# Altium project DisplayPCB.PrjPcb (part 1 of 3)
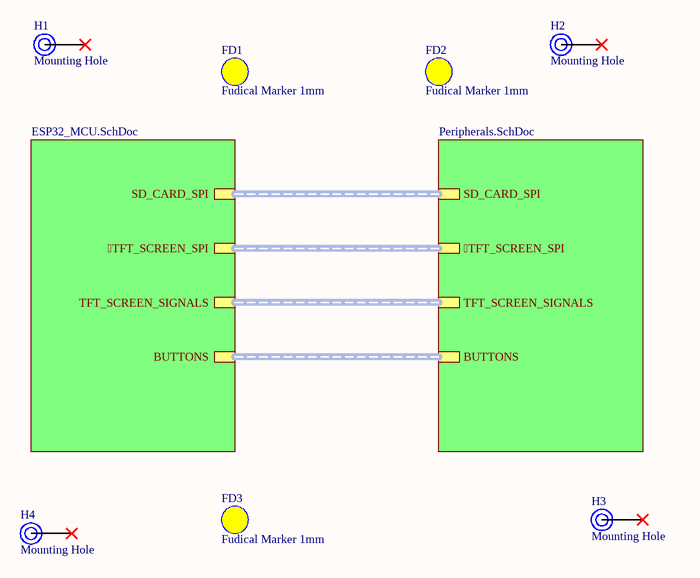
[diagram p0: DisplaySheet.SchDoc]
3 sheets, 108 parts. Net scope: hierarchical (ports join the sheet entries above them; power ports are global).
Board file: DisplayPCB.PcbDoc
Sheets:
  DisplaySheet.SchDoc
    U_ESP32_MCU = ESP32_MCU.SchDoc
    U_Peripherals = Peripherals.SchDoc

## Sheet DisplaySheet.SchDoc
size A4; SheetNumber: 1; SheetTotal: 3

### Parts
FD1  Fudical Marker 1mm  [FIDUCIAL-1MM]
FD2  Fudical Marker 1mm  [FIDUCIAL-1MM]
FD3  Fudical Marker 1mm  [FIDUCIAL-1MM]
H1  Mounting Hole  [Mounting Holes-Footprint-1]
H2  Mounting Hole  [Mounting Holes-Footprint-1]
H3  Mounting Hole  [Mounting Holes-Footprint-1]
H4  Mounting Hole  [Mounting Holes-Footprint-1]

### Sub-sheets
U_ESP32_MCU = ESP32_MCU.SchDoc: SD_CARD_SPI (harness SD_CARD_SPI), TFT_SCREEN_SPI (harness TFT_SCREEN_SPI), TFT_SCREEN_SIGNALS (harness TFT_SCREEN_SIGNALS), BUTTONS (harness BUTTONS)
U_Peripherals = Peripherals.SchDoc: SD_CARD_SPI (harness SD_CARD_SPI), TFT_SCREEN_SPI (harness TFT_SCREEN_SPI), TFT_SCREEN_SIGNALS (harness TFT_SCREEN_SIGNALS), BUTTONS (harness BUTTONS)

### Nets

Not connected (* = marked no-connect by the designer): H1 0*; H2 0*; H3 0*; H4 0*

### Buses and harness runs
harness sheet U_ESP32_MCU/TFT_SCREEN_SPI = sheet U_Peripherals/TFT_SCREEN_SPI
harness sheet U_ESP32_MCU/BUTTONS = sheet U_Peripherals/BUTTONS
harness sheet U_ESP32_MCU/SD_CARD_SPI = sheet U_Peripherals/SD_CARD_SPI
harness sheet U_ESP32_MCU/TFT_SCREEN_SIGNALS = sheet U_Peripherals/TFT_SCREEN_SIGNALS

### Library data of the parts
FD1-FD3 = FD
H1-H4 = CMP-108-0002-3: Mechanical mounting hole for vertical stack

## Sheet ESP32_MCU.SchDoc
size A2; SheetNumber: 2; SheetTotal: 3
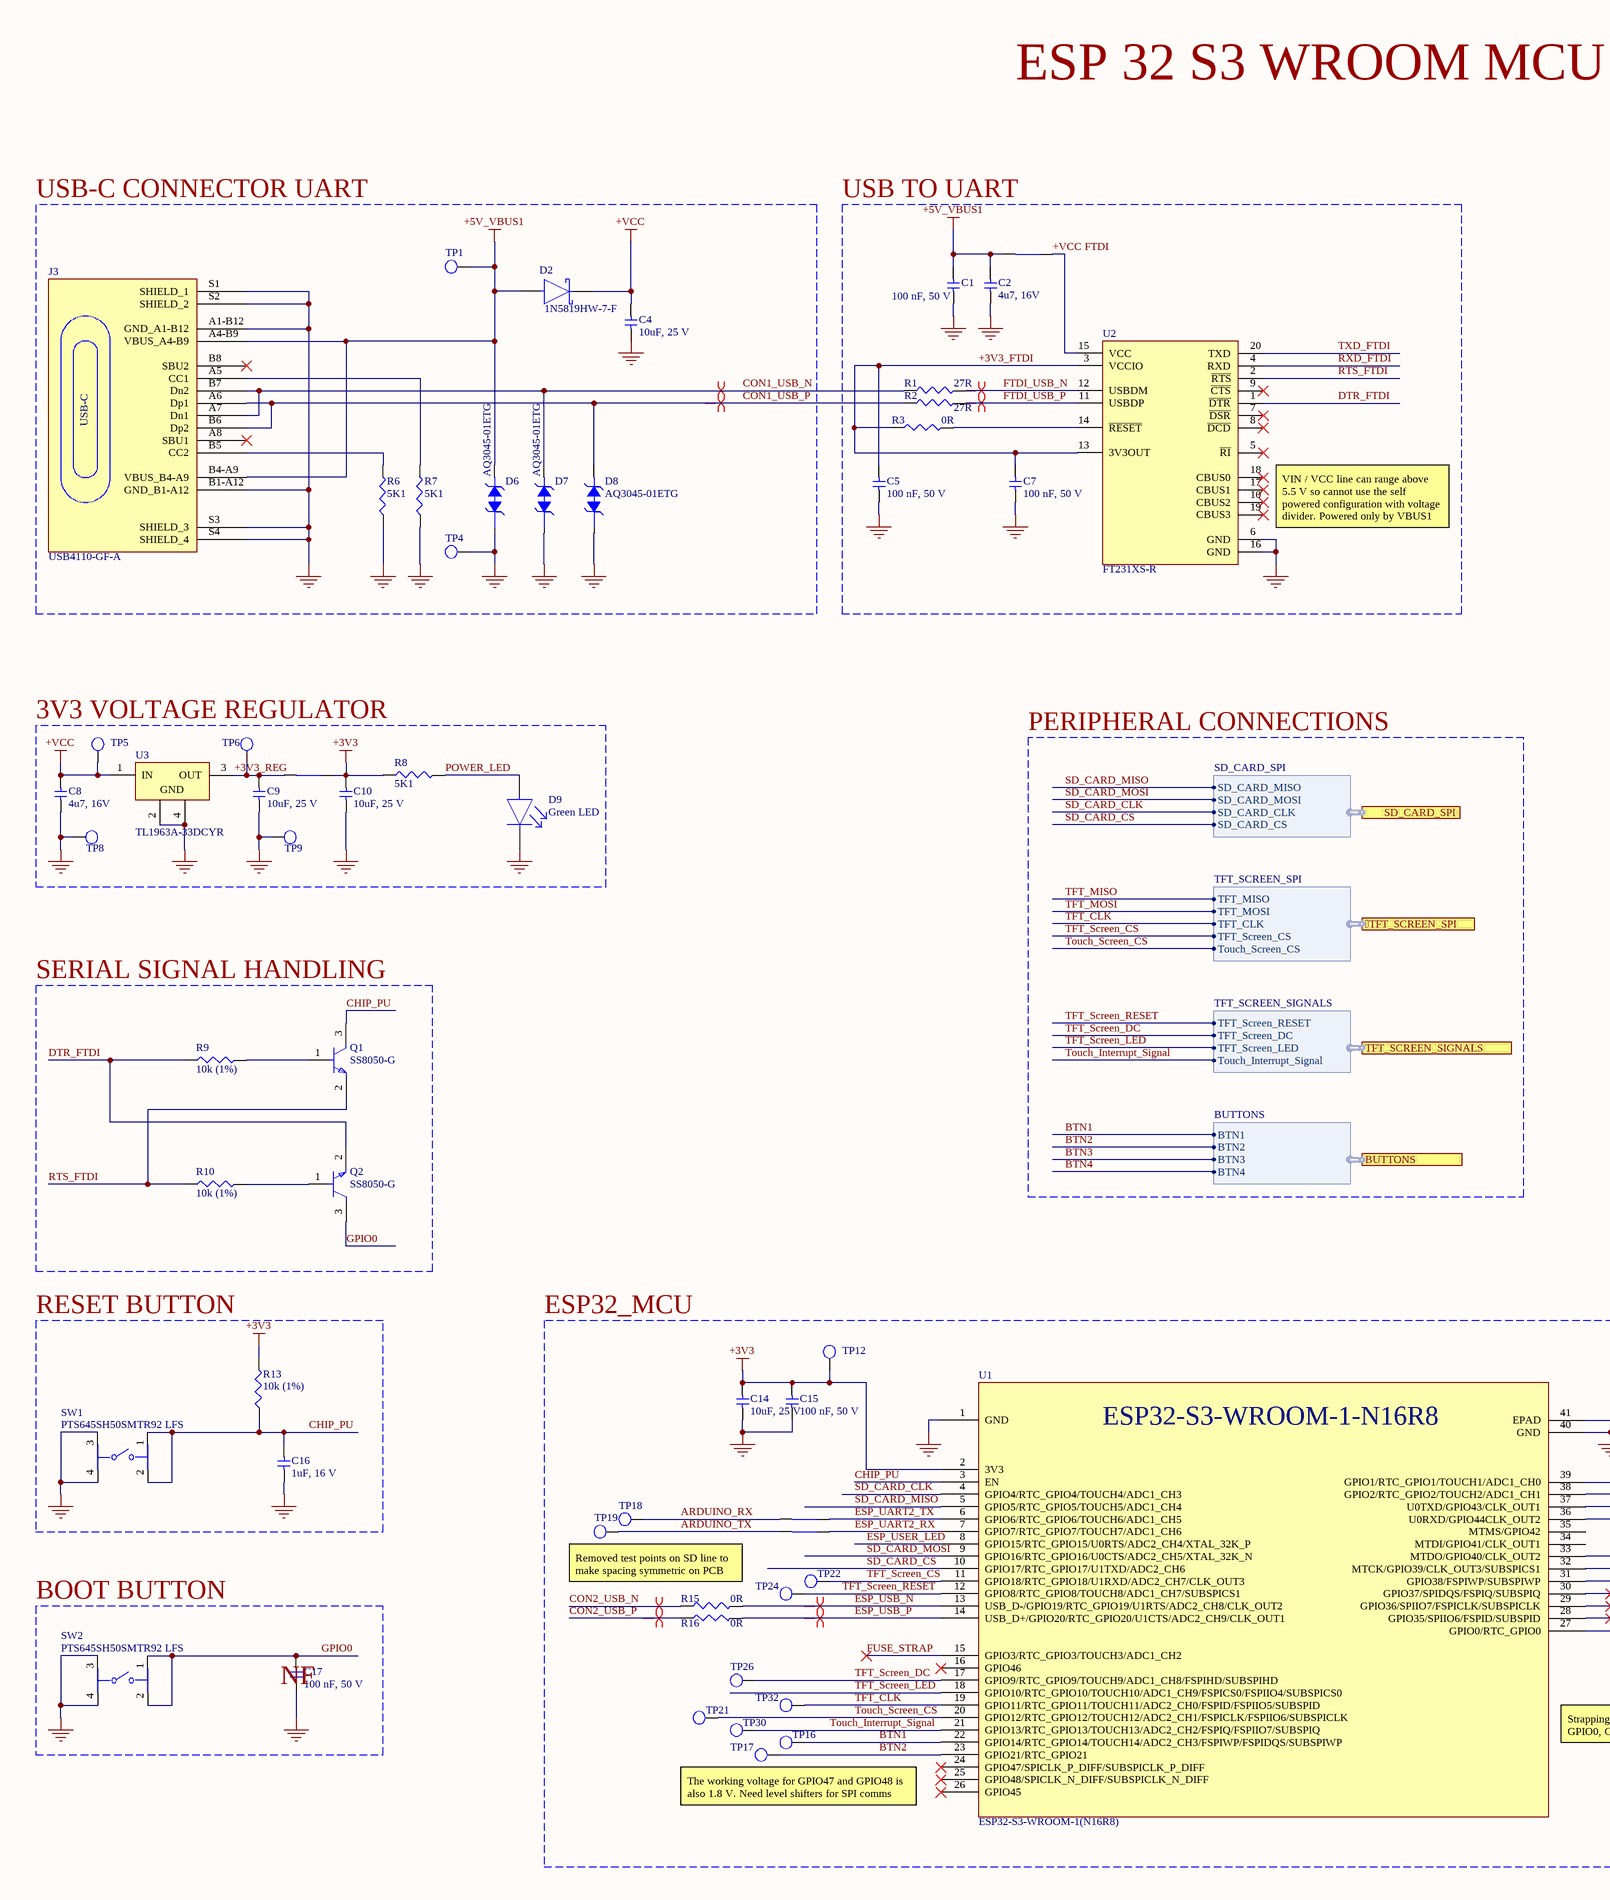
[diagram p1: ESP32_MCU.SchDoc, left]
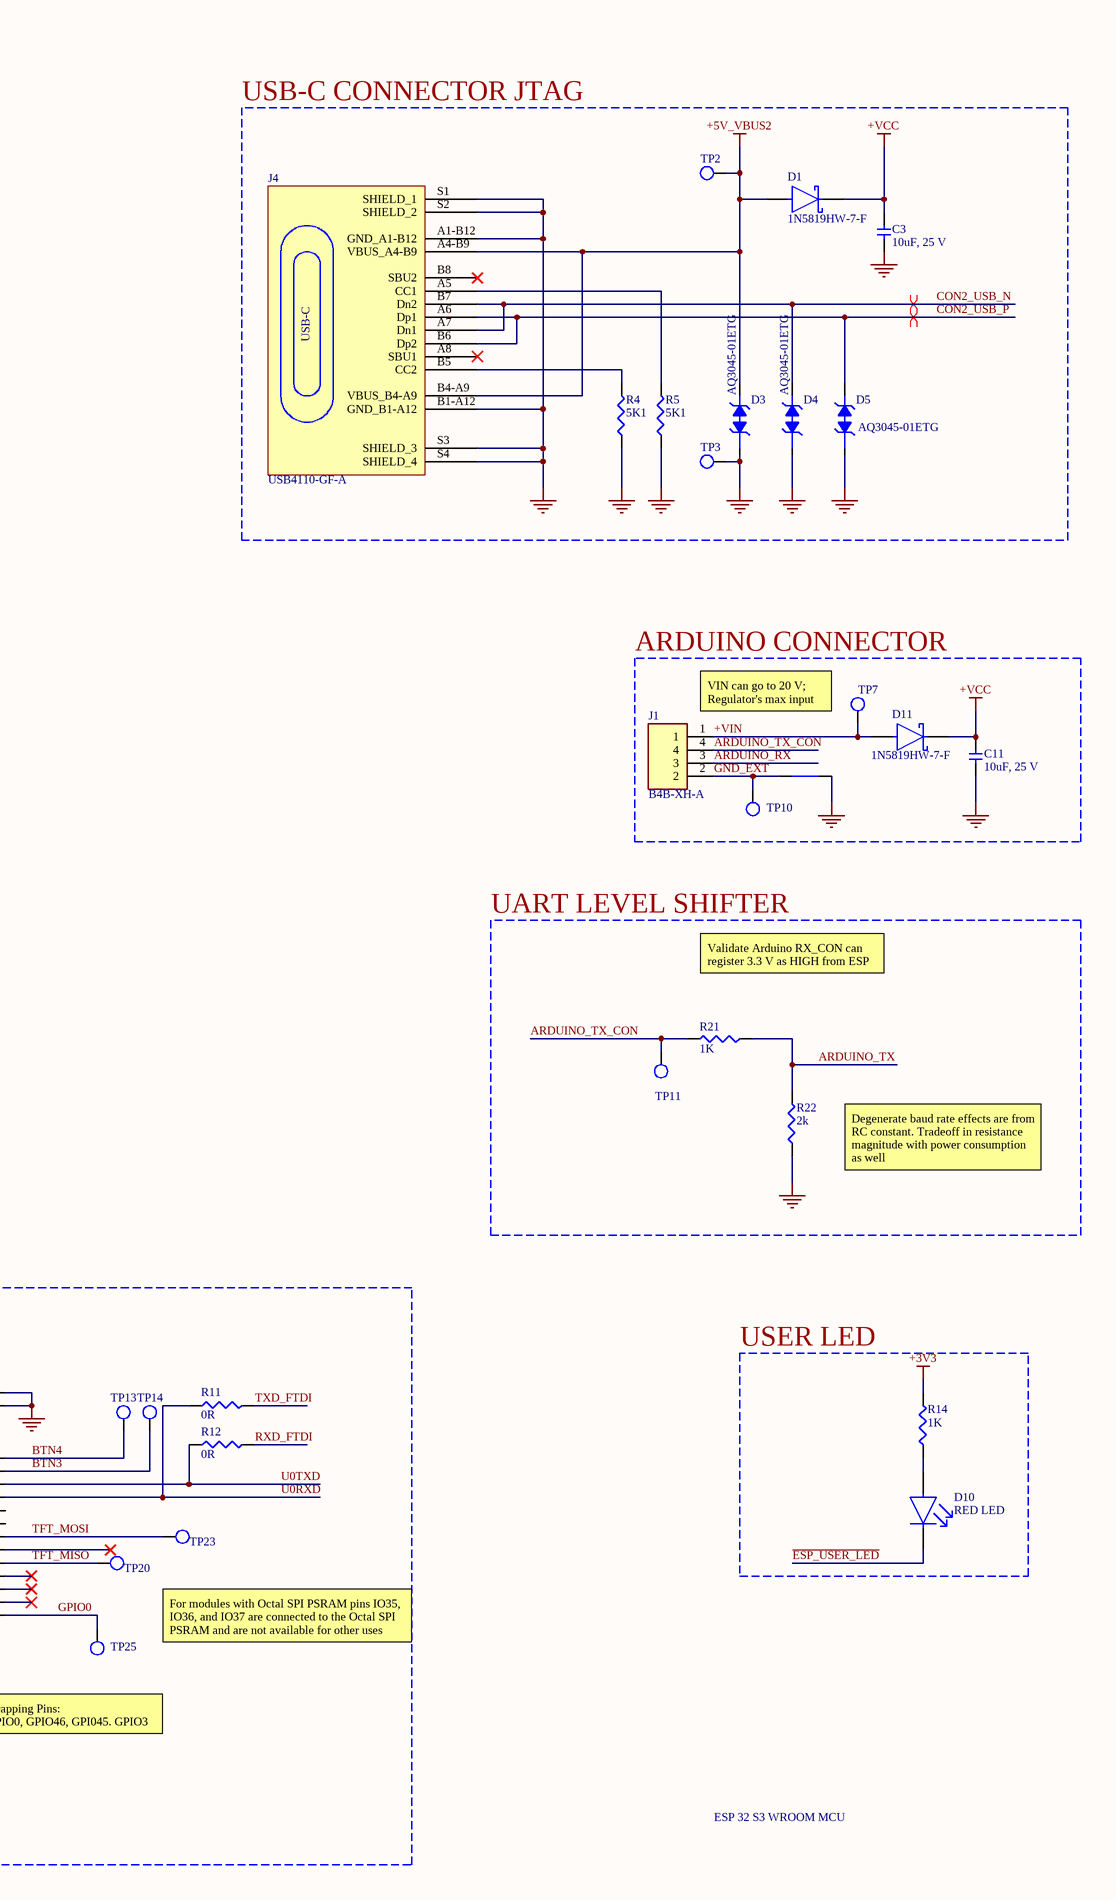
[diagram p2: ESP32_MCU.SchDoc, right]

### Parts
C1  100 nF, 50 V  [0805_CAP]
C2  4u7, 16V  [0805_CAP]
C3  10uF, 25 V  [0805_CAP]
C4  10uF, 25 V  [0805_CAP]
C5  100 nF, 50 V  [0805_CAP]
C7  100 nF, 50 V  [0805_CAP]
C8  4u7, 16V  [0805_CAP]
C9  10uF, 25 V  [0805_CAP]
C10  10uF, 25 V  [0805_CAP]
C11  10uF, 25 V  [0805_CAP]
C14  10uF, 25 V  [0805_CAP]
C15  100 nF, 50 V  [0805_CAP]
C16  1uF, 16 V  [0805_CAP]
C17  100 nF, 50 V  [0805_CAP]
D1  1N5819HW-7-F  [FP-SOD123-IPC_B]
D2  1N5819HW-7-F  [FP-SOD123-IPC_B]
D3  AQ3045-01ETG  [SOD882]
D4  AQ3045-01ETG  [SOD882]
D5  AQ3045-01ETG  [SOD882]
D6  AQ3045-01ETG  [SOD882]
D7  AQ3045-01ETG  [SOD882]
D8  AQ3045-01ETG  [SOD882]
D9  Green LED  [FP-LTST-C171KGKT-MFG]
D10  RED LED  [LTST-C170KRKT_V]
D11  1N5819HW-7-F  [FP-SOD123-IPC_B]
J1  B4B-XH-A  [JST_B4B-XH-A(LF)(SN)]
J3  USB4110-GF-A  [FP-USB4110-GF-A-MFG]
J4  USB4110-GF-A  [FP-USB4110-GF-A-MFG]
NT1  NT  [NetTie_SMD]  (value not drawn)  (net tie, no BOM)
NT2  NT  [NetTie_SMD]  (value not drawn)  (net tie, no BOM)
NT3  NT  [NetTie_SMD]  (value not drawn)  (net tie, no BOM)
NT6  NT  [NetTie_SMD]  (value not drawn)  (net tie, no BOM)
NT8  NT  [NetTie_SMD]  (value not drawn)  (net tie, no BOM)
Q1  SS8050-G  [FP-SS8050-G-IPC_A]
Q2  SS8050-G  [FP-SS8050-G-IPC_A]
R1  27R  [0805_Resistor]
R2  27R  [0805_Resistor]
R3  0R  [0805_Resistor]
R4  5K1  [0805_Resistor]
R5  5K1  [0805_Resistor]
R6  5K1  [0805_Resistor]
R7  5K1  [0805_Resistor]
R8  5K1  [0805_Resistor]
R9  10k (1%)  [0805_Resistor]
R10  10k (1%)  [0805_Resistor]
R11  0R  [0805_Resistor]
R12  0R  [0805_Resistor]
R13  10k (1%)  [0805_Resistor]
R14  1K  [0805_Resistor]
R15  0R  [0805_Resistor]
R16  0R  [0805_Resistor]
R21  1K  [0805_Resistor]
R22  2k  [0805_Resistor]
SW1  PTS645SH50SMTR92 LFS  [FP-PTS645SH50SMTR92LFS-MFG]
SW2  PTS645SH50SMTR92 LFS  [FP-PTS645SH50SMTR92LFS-MFG]
TP1  Test Point  [Probe-Point]  (value not drawn)
TP2  Test Point  [Probe-Point]  (value not drawn)
TP3  Test Point  [Probe-Point]  (value not drawn)
TP4  Test Point  [Probe-Point]  (value not drawn)
TP5  Test Point  [Probe-Point]  (value not drawn)
TP6  Test Point  [Probe-Point]  (value not drawn)
TP7  Test Point  [Probe-Point]  (value not drawn)
TP8  Test Point  [Probe-Point]  (value not drawn)
TP9  Test Point  [Probe-Point]  (value not drawn)
TP10  Test Point  [Probe-Point]  (value not drawn)
TP11  Test Point  [Probe-Point]  (value not drawn)
TP12  Test Point  [Probe-Point]  (value not drawn)
TP13  Test Point  [Probe-Point]  (value not drawn)
TP14  Test Point  [Probe-Point]  (value not drawn)
TP16  Test Point  [Probe-Point]  (value not drawn)
TP17  Test Point  [Probe-Point]  (value not drawn)
TP18  Test Point  [Probe-Point]  (value not drawn)
TP19  Test Point  [Probe-Point]  (value not drawn)
TP20  Test Point  [Probe-Point]  (value not drawn)
TP21  Test Point  [Probe-Point]  (value not drawn)
TP22  Test Point  [Probe-Point]  (value not drawn)
TP23  Test Point  [Probe-Point]  (value not drawn)
TP24  Test Point  [Probe-Point]  (value not drawn)
TP25  Test Point  [Probe-Point]  (value not drawn)
TP26  Test Point  [Probe-Point]  (value not drawn)
TP30  Test Point  [Probe-Point]  (value not drawn)
TP32  Test Point  [Probe-Point]  (value not drawn)
U1  ESP32-S3-WROOM-1(N16R8)  [ESP32S3WROOM1N8R2]
U2  FT231XS-R  [FP-SSOP-20-IPC_A]
U3  TL1963A-33DCYR  [DCY0004A_N]

### Blocks framed on the sheet
USB-C CONNECTOR UART: C4 D2 D6-D8 J3 R6 R7 TP1 TP4
USB TO UART: C1 C2 C5 C7 NT6 R1-R3 U2
USB-C CONNECTOR JTAG: C3 D1 D3-D5 J4 R4 R5 TP2 TP3
3V3 VOLTAGE REGULATOR: C8-C10 D9 NT3 R8 TP5 TP6 TP8 TP9 U3
ARDUINO CONNECTOR: C11 D11 J1 NT8 TP7 TP10
UART LEVEL SHIFTER: R21 R22 TP11
SERIAL SIGNAL HANDLING: Q1 Q2 R9 R10
RESET BUTTON: C16 R13 SW1
ESP32_MCU: C14 C15 NT1 NT2 R11 R12 R15 R16 TP12-TP14 TP16-TP26 TP30 TP32 U1
USER LED: D10 R14

### Ports
TFT_SCREEN_SPI (harness TFT_SCREEN_SPI, see DisplaySheet[2B], Peripherals[2C]), BUTTONS (harness BUTTONS, see DisplaySheet[2C], Peripherals[2D]), SD_CARD_SPI (harness SD_CARD_SPI, see DisplaySheet[2B], Peripherals[2C]), TFT_SCREEN_SIGNALS (harness TFT_SCREEN_SIGNALS, see DisplaySheet[2C], Peripherals[2D])

### Harnesses
SD_CARD_SPI: SD_CARD_MISO, SD_CARD_MOSI, SD_CARD_CLK, SD_CARD_CS
TFT_SCREEN_SPI: TFT_MISO, TFT_MOSI, TFT_CLK, TFT_Screen_CS, Touch_Screen_CS
TFT_SCREEN_SIGNALS: TFT_Screen_RESET, TFT_Screen_DC, TFT_Screen_LED, Touch_Interrupt_Signal
BUTTONS: BTN1, BTN2, BTN3, BTN4

### Nets
+3V3: C10.2 C14.2 C15.2 NT3.2 R8.1 R13.2 R14.2 TP12.1 U1.2(3V3)
+5V_VBUS1: C1.2 C2.2 D2.2(A) D6.1 J3.A4-B9(VBUS_A4-B9) J3.B4-A9(VBUS_B4-A9) NT6.1 TP1.1
+5V_VBUS2: D1.2(A) D3.1 J4.A4-B9(VBUS_A4-B9) J4.B4-A9(VBUS_B4-A9) TP2.1
+VCC: C3.2 C4.2 C8.2 C11.2 D1.1(C) D2.1(C) D11.1(C) TP5.1 U3.1(IN)
GND: C1.1 C2.1 C3.1 C4.1 C5.1 C7.1 C8.1 C9.1 C10.1 C11.1 C14.1 C15.1 C16.1 C17.1 D3.2 D4.2 D5.2 D6.2 D7.2 D8.2 D9.1(C) J3.A1-B12(GND_A1-B12) J3.B1-A12(GND_B1-A12) J3.S1(SHIELD_1) J3.S2(SHIELD_2) J3.S3(SHIELD_3) J3.S4(SHIELD_4) J4.A1-B12(GND_A1-B12) J4.B1-A12(GND_B1-A12) J4.S1(SHIELD_1) J4.S2(SHIELD_2) J4.S3(SHIELD_3) J4.S4(SHIELD_4) NT8.2 R4.1 R5.1 R6.1 R7.1 R22.1 SW1.3 SW1.4 SW2.3 SW2.4 TP3.1 TP4.1 TP8.1 TP9.1 U1.1(GND) U1.40(GND) U1.41(EPAD) U2.6(GND) U2.16(GND) U3.2(GND) U3.4(GND)
+3V3_FTDI: C5.2 C7.2 R3.1 U2.3(VCCIO) U2.13(3V3OUT)
+3V3_REG: C9.2 NT3.1 TP6.1 U3.3(OUT)
+VCC FTDI: NT6.2 U2.15(VCC)
+VIN: D11.2(A) J1.1 TP7.1
~{ESP_USER_LED}: D10.1(C) U1.8(GPIO15/RTC_GPIO15/U0RTS/ADC2_CH4/XTAL_32K_P)
ARDUINO_RX: J1.3 NT1.1 TP18.1
ARDUINO_TX: NT2.1 R21.1 R22.2 TP19.1
ARDUINO_TX_CON: J1.4 R21.2 TP11.1
BTN1: TP16.1 U1.22(GPIO14/RTC_GPIO14/TOUCH14/ADC2_CH3/FSPIWP/FSPIDQS/SUBSPIWP) ; port BUTTONS.BTN1
BTN2: TP17.1 U1.23(GPIO21/RTC_GPIO21) ; port BUTTONS.BTN2
BTN3: TP14.1 U1.38(GPIO2/RTC_GPIO2/TOUCH2/ADC1_CH1) ; port BUTTONS.BTN3
BTN4: TP13.1 U1.39(GPIO1/RTC_GPIO1/TOUCH1/ADC1_CH0) ; port BUTTONS.BTN4
CHIP_PU: C16.2 Q1.3(C) R13.1 SW1.1 SW1.2 U1.3(EN)
CON1_USB_N: D7.1 J3.A7(Dn1) J3.B7(Dn2) R1.1
CON1_USB_P: D8.1 J3.A6(Dp1) J3.B6(Dp2) R2.1
CON2_USB_N: D4.1 J4.A7(Dn1) J4.B7(Dn2) R15.1
CON2_USB_P: D5.1 J4.A6(Dp1) J4.B6(Dp2) R16.1
DTR_FTDI: Q2.2(E) R9.1 U2.1(~{DTR})
ESP_UART2_RX: NT2.2 U1.7(GPIO7/RTC_GPIO7/TOUCH7/ADC1_CH6)
ESP_UART2_TX: NT1.2 U1.6(GPIO6/RTC_GPIO6/TOUCH6/ADC1_CH5)
ESP_USB_N: R15.2 U1.13(USB_D-/GPIO19/RTC_GPIO19/U1RTS/ADC2_CH8/CLK_OUT2)
ESP_USB_P: R16.2 U1.14(USB_D+/GPIO20/RTC_GPIO20/U1CTS/ADC2_CH9/CLK_OUT1)
FTDI_USB_N: R1.2 U2.12(USBDM)
FTDI_USB_P: R2.2 U2.11(USBDP)
FUSE_STRAP: U1.15(GPIO3/RTC_GPIO3/TOUCH3/ADC1_CH2)
GND_EXT: J1.2 NT8.1 TP10.1
GPIO0: C17.2 Q2.3(C) SW2.1 SW2.2 TP25.1 U1.27(GPIO0/RTC_GPIO0)
POWER_LED: D9.2(A) R8.2
RTS_FTDI: Q1.2(E) R10.1 U2.2(~{RTS})
RXD_FTDI: R12.2 U2.4(RXD)
SD_CARD_CLK: U1.4(GPIO4/RTC_GPIO4/TOUCH4/ADC1_CH3) ; port SD_CARD_SPI.SD_CARD_CLK
SD_CARD_CS: U1.10(GPIO17/RTC_GPIO17/U1TXD/ADC2_CH6) ; port SD_CARD_SPI.SD_CARD_CS
SD_CARD_MISO: U1.5(GPIO5/RTC_GPIO5/TOUCH5/ADC1_CH4) ; port SD_CARD_SPI.SD_CARD_MISO
SD_CARD_MOSI: U1.9(GPIO16/RTC_GPIO16/U0CTS/ADC2_CH5/XTAL_32K_N) ; port SD_CARD_SPI.SD_CARD_MOSI
TFT_CLK: TP32.1 U1.19(GPIO11/RTC_GPIO11/TOUCH11/ADC2_CH0/FSPID/FSPIIO5/SUBSPID) ; port TFT_SCREEN_SPI.TFT_CLK
TFT_MISO: TP20.1 U1.31(GPIO38/FSPIWP/SUBSPIWP) ; port TFT_SCREEN_SPI.TFT_MISO
TFT_MOSI: TP23.1 U1.33(MTDO/GPIO40/CLK_OUT2) ; port TFT_SCREEN_SPI.TFT_MOSI
TFT_Screen_CS: TP22.1 U1.11(GPIO18/RTC_GPIO18/U1RXD/ADC2_CH7/CLK_OUT3) ; port TFT_SCREEN_SPI.TFT_Screen_CS
TFT_Screen_DC: TP26.1 U1.17(GPIO9/RTC_GPIO9/TOUCH9/ADC1_CH8/FSPIHD/SUBSPIHD) ; port TFT_SCREEN_SIGNALS.TFT_Screen_DC
TFT_Screen_LED: U1.18(GPIO10/RTC_GPIO10/TOUCH10/ADC1_CH9/FSPICS0/FSPIIO4/SUBSPICS0) ; port TFT_SCREEN_SIGNALS.TFT_Screen_LED
TFT_Screen_RESET: TP24.1 U1.12(GPIO8/RTC_GPIO8/TOUCH8/ADC1_CH7/SUBSPICS1) ; port TFT_SCREEN_SIGNALS.TFT_Screen_RESET
Touch_Interrupt_Signal: TP30.1 U1.21(GPIO13/RTC_GPIO13/TOUCH13/ADC2_CH2/FSPIQ/FSPIIO7/SUBSPIQ) ; port TFT_SCREEN_SIGNALS.Touch_Interrupt_Signal
Touch_Screen_CS: TP21.1 U1.20(GPIO12/RTC_GPIO12/TOUCH12/ADC2_CH1/FSPICLK/FSPIIO6/SUBSPICLK) ; port TFT_SCREEN_SPI.Touch_Screen_CS
TXD_FTDI: R11.2 U2.20(TXD)
U0RXD: R11.1 U1.36(U0RXD/GPIO44CLK_OUT2)
U0TXD: R12.1 U1.37(U0TXD/GPIO43/CLK_OUT1)
NetD10_2: D10.2(A) R14.1
NetJ3_A5: J3.A5(CC1) R7.2
NetJ3_B5: J3.B5(CC2) R6.2
NetJ4_A5: J4.A5(CC1) R5.2
NetJ4_B5: J4.B5(CC2) R4.2
NetQ1_1: Q1.1(B) R9.2
NetQ2_1: Q2.1(B) R10.2
NetR3_2: R3.2 U2.14(~{RESET})

Not connected (* = marked no-connect by the designer): J3 A8(SBU1)* B8(SBU2)*; J4 A8(SBU1)* B8(SBU2)*; U1 16(GPIO46)* 24(GPIO47/SPICLK_P_DIFF/SUBSPICLK_P_DIFF)* 25(GPIO48/SPICLK_N_DIFF/SUBSPICLK_N_DIFF)* 26(GPIO45)* 28(GPIO35/SPIIO6/FSPID/SUBSPID)* 29(GPIO36/SPIIO7/FSPICLK/SUBSPICLK)* 30(GPIO37/SPIDQS/FSPIQ/SUBSPIQ)* 32(MTCK/GPIO39/CLK_OUT3/SUBSPICS1)* 34(MTDI/GPIO41/CLK_OUT1) 35(MTMS/GPIO42); U2 5(~{RI})* 7(~{DSR})* 8(~{DCD})* 9(~{CTS})* 10(CBUS2)* 17(CBUS1)* 18(CBUS0)* 19(CBUS3)*

### Layout directives
differential pair; differential pair class DIFF90: CON1_USB_N, CON1_USB_P, CON2_USB_N, CON2_USB_P, ESP_USB_N, ESP_USB_P, FTDI_USB_N, FTDI_USB_P

### Notes on the sheet
- ESP 32 S3 WROOM MCU
- (near U2) VIN / VCC line can range above 5.5 V so cannot use the self powered configuration with voltage divider. Powered only by VBUS1
- PERIPHERAL CONNECTIONS
- VIN can go to 20 V; Regulator's max input
- Validate Arduino RX_CON can register 3.3 V as HIGH from ESP
- Degenerate baud rate effects are from RC constant. Tradeoff in resistance magnitude with power consumption as well
- (near TP19) Removed test points on SD line to make spacing symmetric on PCB antenna side and without the antenna. Can use female header to test
- BOOT BUTTON
- For modules with Octal SPI PSRAM pins IO35, IO36, and IO37 are connected to the Octal SPI PSRAM and are not available for other uses
- (near C17) NF
- (near U1) Strapping Pins:
  GPIO0, GPIO46, GPI045. GPIO3
- (near TP17) The working voltage for GPIO47 and GPIO48 is also 1.8 V. Need level shifters for SPI comms
- (in symbol ESP32-S3-WROOM-1(N16R8)) ESP32-S3-WROOM-1-N16R8
- (in symbol USB4110-GF-A) USB-C